# Altium schematic sheet HEBoard_schematic_Ver3.SchDoc
size A4; SheetNumber: 1; SheetTotal: 1
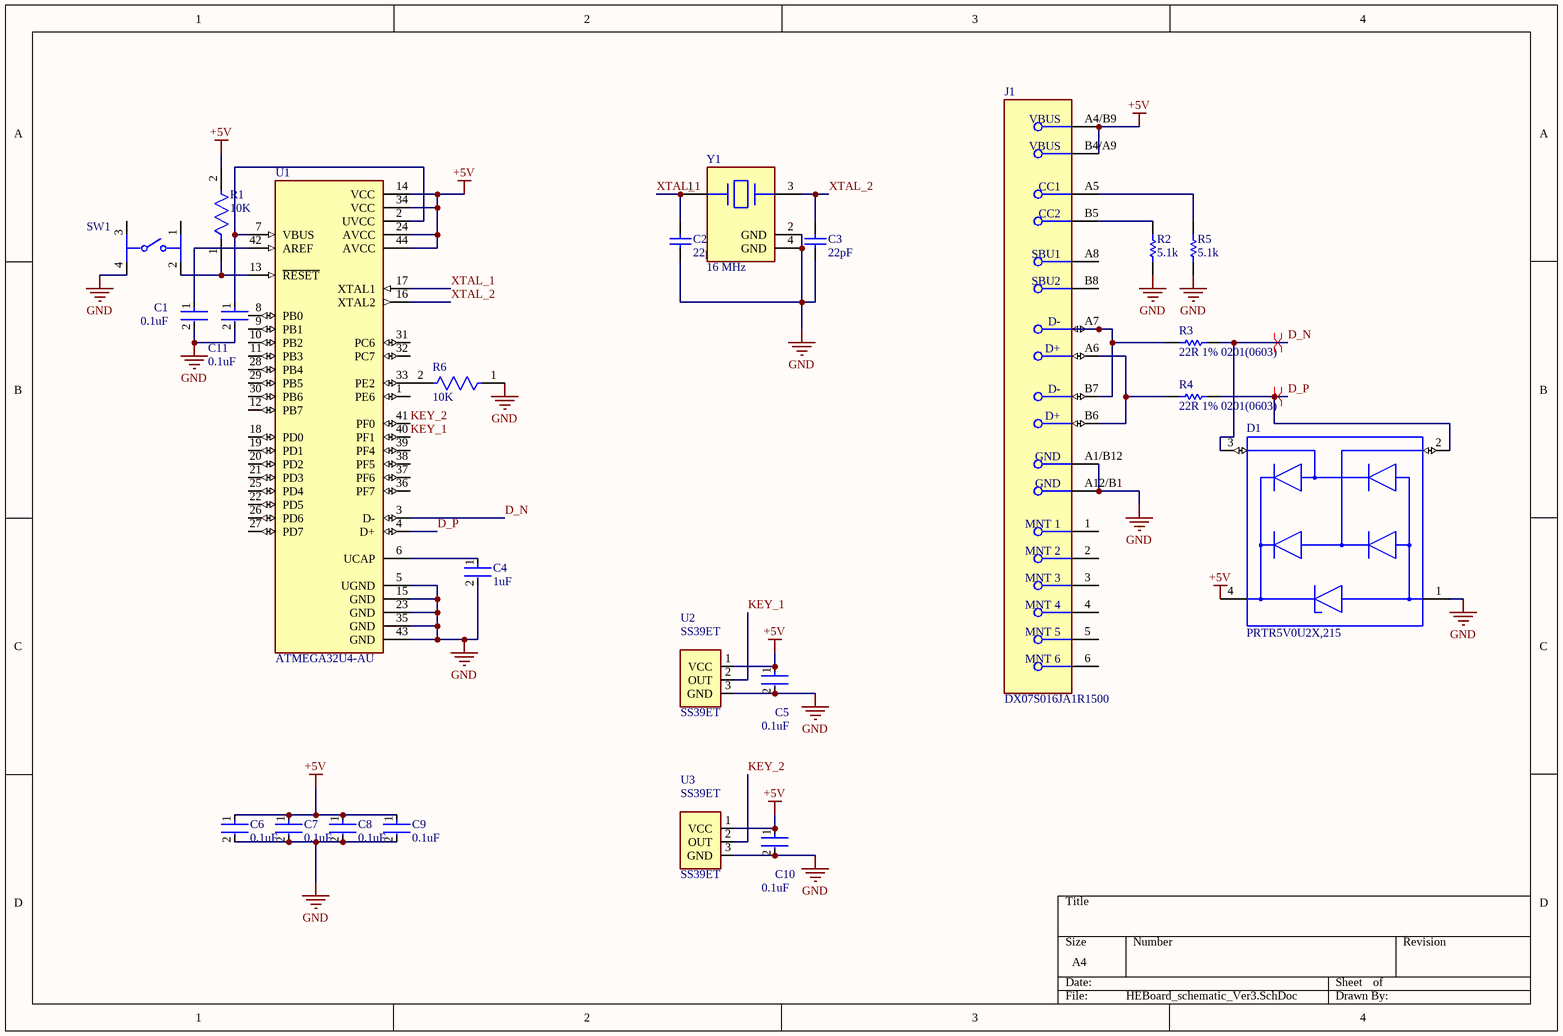
[diagram p0: HEBoard_schematic_Ver3.SchDoc]

## Parts
C1  0.1uF  [FP-GRM033-0_03-IPC_C]
C2  22pF  [CAPC1006X50X20ML10T10]
C3  22pF  [CAPC1006X50X20ML10T10]
C4  1uF  [FP-GRM15-0_1-MFG]
C5  0.1uF  [FP-GRM033-0_03-IPC_C]
C6  0.1uF  [FP-CC0402-MFG]
C7  0.1uF  [FP-CC0402-MFG]
C8  0.1uF  [FP-CC0402-MFG]
C9  0.1uF  [FP-CC0402-MFG]
C10  0.1uF  [FP-GRM033-0_03-IPC_C]
C11  0.1uF  [FP-GRM033-0_03-IPC_C]
D1  PRTR5V0U2X,215  [FP-SOT143B-MFG]
J1  DX07S016JA1R1500  [FP-DX07S016JA1R1500-MFG]
R1  10K  [FP-CRGP0603-IPC_C]
R2  5.1k  [RESC0603X26X15ML03T05]
R3  22R 1% 0201(0603)  [RESC0201(0603)_M]
R4  22R 1% 0201(0603)  [RESC0201(0603)_M]
R5  5.1k  [RESC0603X26X15ML03T05]
R6  10K  [FP-CRGP0603-IPC_C]
SW1  (no value)  [FP-PTS645SM43SMTR92LFS-MFG]
U1  ATMEGA32U4-AU  [QFP80P1200X1200X120-44N]
U2  SS39ET  [CHRY-MX1A-11NW_V]
U3  SS39ET  [CHRY-MX1A-11NW_V]
Y1  16 MHz  [FP-ABM8G-MFG]

## Nets
+5V: C5.1 C6.1 C7.1 C8.1 C9.1 C10.1 D1.4(VCC) J1.A4/B9(VBUS) J1.B4/A9(VBUS) R1.2 U1.14(VCC) U1.24(AVCC) U1.34(VCC) U1.44(AVCC) U2.1(VCC) U3.1(VCC)
GND: C1.2 C2.1 C3.1 C4.2 C5.2 C6.2 C7.2 C8.2 C9.2 C10.2 C11.2 D1.1(GND) J1.A1/B12(GND) J1.A12/B1(GND) R2.1 R5.1 R6.1 SW1.4 U1.5(UGND) U1.15(GND) U1.23(GND) U1.35(GND) U1.43(GND) U2.3(GND) U3.3(GND) Y1.2(GND) Y1.4(GND)
D_N: D1.3(I/O_2) R3.2 U1.3(D-)
D_P: D1.2(I/O_1) R4.2 U1.4(D+)
KEY_1: U1.40(PF1) U2.2(OUT)
KEY_2: U1.41(PF0) U3.2(OUT)
XTAL_1: C2.2 U1.17(XTAL1) Y1.1
XTAL_2: C3.2 U1.16(XTAL2) Y1.3
NetC1_1: C1.1 U1.42(AREF)
NetC4_1: C4.1 U1.6(UCAP)
NetC11_1: C11.1 U1.2(UVCC) U1.7(VBUS)
NetJ1_A5: J1.A5(CC1) R5.2
NetJ1_A6: J1.A6(D+) J1.B6(D+) R4.1
NetJ1_A7: J1.A7(D-) J1.B7(D-) R3.1
NetJ1_B5: J1.B5(CC2) R2.2
NetR1_1: R1.1 SW1.2 U1.13(~{RESET})
NetR6_2: R6.2 U1.33(PE2)

Not connected (* = marked no-connect by the designer): J1 1(MNT_1) 2(MNT_2) 3(MNT_3) 4(MNT_4) 5(MNT_5) 6(MNT_6) A8(SBU1) B8(SBU2); SW1 1 3; U1 1(PE6) 8(PB0) 9(PB1) 10(PB2) 11(PB3) 12(PB7) 18(PD0) 19(PD1) 20(PD2) 21(PD3) 22(PD5) 25(PD4) 26(PD6) 27(PD7) 28(PB4) 29(PB5) 30(PB6) 31(PC6) 32(PC7) 36(PF7) 37(PF6) 38(PF5) 39(PF4)

## Layout directives
differential pair: D_N, D_P

## Library data of the parts
C1 C5 C10 C11 = CMP-2010-01264-2: Chip Multilayer Ceramic Capacitors for General Purpose, 0201, 0.10uF, X5R, 15%, 10%, 10V; Capacitance: 100nF; Mount: Surface Mount; Dielectric: X5R; Width: 0.012inch; Tolerance: 10%; Radiation Hardening: No; Voltage Rating: 10V; REACH SVHC: No SVHC; Height: 0.3mm; Max Operating Temperature: 85°C; Voltage Rating (DC): 10V; Thickness: 0.013inch; Termination: SMD/SMT; Lead Free: Lead Free; Package Quantity: 1; Case/Package: 0201; Min Operating Temperature: -55°C; Weight: 6E-06oz; Length: 0.6mm; Case Code (Imperial): 0201; Depth: 0.3mm; Voltage: 10V; Packaging: Tape and Reel; Case Code (Metric): 0603
C2 C3 = CMP-2008-04844-1: Part Number: 0402ZK220GBSTR..; Manufacturer: AVX Interconnect / Elco
C4 = CMP-2008-04556-2: CAP CER 1UF 10V X5R 0402; Manufacturer Part Number: GRM155R61A105KE15D; Manufacturer: Murata; Material: Ceramic; Tolerance: 10%; Temperature Coefficient: 15%; Octopart: https://octopart.com/grm155r61a105ke15d-murata-197442; Lead Free: Yes; ComponentLink2Description: Datasheet; Temperature: -55°C to +85°C; Temperature Range High: +85°C; Height: 0.55mm; Capacitance: 1uF; Ipc Land Pattern Name: CAPC10050X50; ComponentLink2URL: https://search.murata.co.jp/Ceramy/image/img/A01X/G101/ENG/GRM155R61A105KE15-01A.pdf; Temperature Range Low: -55°C; Device Class L2: Capacitors; Voltage Rating: 10V; RoHS: TRUE; Device Class L1: Passive Components; Device Class L3: Ceramic Capacitors; Temperature Characteristic: X5R; Mouser Description: 0402 1 uF 10 V ±10% Tolerance X5R Surface Mount Multilayer Ceramic Capacitor; Automotive: No; Package: GRM15-0.1; Digikey Description: CAP CER 1UF 10V X5R 0402; Value: 1uF; Category: Cap
C6-C9 = CMP-03422-000748-1: CAP CER 0.1UF 10V X7R 0402; Manufacturer: YAGEO; Manufacturer Part Number: CC0402KRX7R6BB104; Description: CC0402 100 nF X7R 10.00% 10 V; Tolerance: 0.1; Value: 100 nF; Temperature Coefficient: 30ppm/°C; Material: Ceramic; Automotive Grade: NA; Ipc Land Pattern Name: CAPC10050X50; Temperature Range Low: -55°C; Temperature: -55°C to +125°C; Footprint Url: http://www.yageo.com/exep/pages/download/literatures/UPY-C_GEN_24.pdf; Device Class L2: Capacitors; ComponentLink2Description: Datasheet; Temperature Characteristic: X7R; Height: 0.55mm; Mouser Description: Multilayer Ceramic Capacitors MLCC - SMD/SMT 100nF 10V X7R 10%; Temperature Range High: +125°C; Package: CC0402; Digikey Description: CAP CER 0.1UF 10V X7R 0402; Automotive: No; Voltage Rating: 10 V; Octopart: https://octopart.com/cc0402krx7r6bb104-yageo-8376509; Capacitance: 100 nF; ComponentLink2URL: http://www.yageo.com/documents/recent/UPY-GP_NP0_16V-to-50V_16.pdf; Category: Cap; Lead Free: Yes; Device Class L3: Ceramic Capacitors; RoHS: TRUE; Device Class L1: Passive Components
D1 = CMP-14436-000007-1: TVS DIODE 5.5V SOT143B
J1 = CMP-19038-000003-1: CONN RCP USB2.0 TYP C 24P SMD RA
R1 R6 = CMP-03211-004414-1: CRGP 0603 10K 1%; Manufacturer Part Number: CRGP0603F10K; Manufacturer: TE; Voltage Rating: 50V; Power Rating: 0.25W; Value: 10KΩ; Tolerance: 0.01; Temperature Coefficient: ±100ppm/°C; Octopart: https://octopart.com/crgp0603f10k-te+connectivity-91018721; Temperature Range Low: -55°C; Temperature Range High: +155°C; Device Class L3: Chip SMD Resistors; Package: CRGP0603; Height: 0.55mm; Series: CRGP; RoHS: TRUE; Composition: Thick Film; Digikey Description: CRGP 0603 10K 1%; Ipc Land Pattern Name: RESC16080X45; Mouser Description: Res, 10K, 1%, 0.25W, 0603, Thick Film; ComponentLink2Description: Datasheet; ComponentLink2URL: https://www.te.com/commerce/DocumentDelivery/DDEController?Action=srchrtrv&DocNm=9-1773463-9&DocType=DS&DocLang=English; Temperature: -55°C to +155°C; Device Class L1: Passive Components; Lead Free: Yes; Ambient Temperature Range High: +70°C; Device Class L2: Resistors; Automotive: No; Category: Res; Resistance: 10KΩ
R2 R5 = CMP-2004-03550-1: Part Number: ERJ1GNF5101C; Manufacturer: Panasonic
R3 R4 = CMP-1010-00226-1: 22R 0.05W 1% 0201 (0603 Metric)  SMD; Case-EIA: 0201; Value: 22.00 Ohm; Case-Metric: 0603; Technology: SMT; Power: 0.05 W; Tolerance: 1 %
SW1 = CMP-2000-05160-2: SWITCH TACTILE SPST-NO 0.05A 12V; Contact Resistance: 100mR; Throw Configuration: SPST; Illumination Type: Non-Illuminated; Mechanical Life: 100000Cycles; Current Rating: 50mA; Switch Function: Off-Mom; Actuator Length: 0.85mm; Actuator Material: Nylon; Actuator Type: Standard; Operating Force: 160gf; Min Operating Temperature: -20°C; REACH SVHC: No SVHC; Termination: Gull Wing; Case/Package: SMD/SMT; Packaging: Tape and Reel; Mount: Surface Mount; Voltage Rating (DC): 12V; Orientation: Straight; Lead Free: Lead Free; Contact Material: Silver; Color: Black; Max Current Rating: 50mA; Contact Plating: Silver; Depth: 9mm; Package Quantity: 1; Max Voltage Rating (DC): 12V; Length: 6mm; Max Operating Temperature: 60°C
U1 = ATMEGA32U4-AU: AVR AVRÂ® ATmega Microcontroller IC 8-Bit 16MHz 32KB (16K x 16) FLASH 44-TQFP (10x10); MF: Microchip Technology; Value: *; Purchase-URL: https://pricing.snapeda.com/search/part/ATMEGA32U4-AU/?ref=eda; Availability: In Stock; Price: None; Package: TQFP-44 Microchip; MP: ATMEGA32U4-AU
U2 U3 = SS39ET: analog Hall Effect Sensor 1.5 mA 2.7 - 6.5 V dc | Honeywell SS39ET; MF: Honeywell Sensing and Productivity Solutions; SnapEDA_Link: https://www.snapeda.com/parts/SS39ET/Honeywell+Sensing+and+Productivity+Solutions/view-part/?ref=snap; Package: None; Value: *; MP: SS39ET; Check_prices: https://www.snapeda.com/parts/SS39ET/Honeywell+Sensing+and+Productivity+Solutions/view-part/?ref=eda
Y1 = CMP-27762-015134-1: Crystal 16MHz ±30ppm (Tol) ±30ppm (Stability) 10pF FUND 80Ω 4-Pin SMD T/R; Series Resistance: 80R; Mount: Surface Mount; Width: 0.098inch; Load Capacitance: 10pF; Length: 3.2mm; Series: ABM8G; Max Operating Temperature: 60°C; Depth: 2.5mm; Frequency: 16MHz; Frequency Tolerance: 30ppm; Height: 0.039inch; ESR (Equivalent Series Resistance): 80R; Case/Package: SMD/SMT; Lead Free: Lead Free; Frequency Stability: 30ppm; Packaging: Tape and Reel; Number of Pins: 4; REACH SVHC: No SVHC; Min Operating Temperature: -10°C